# EAGLE schematic iot_solaire_jardin_v2 (EAGLE 9.7.0)
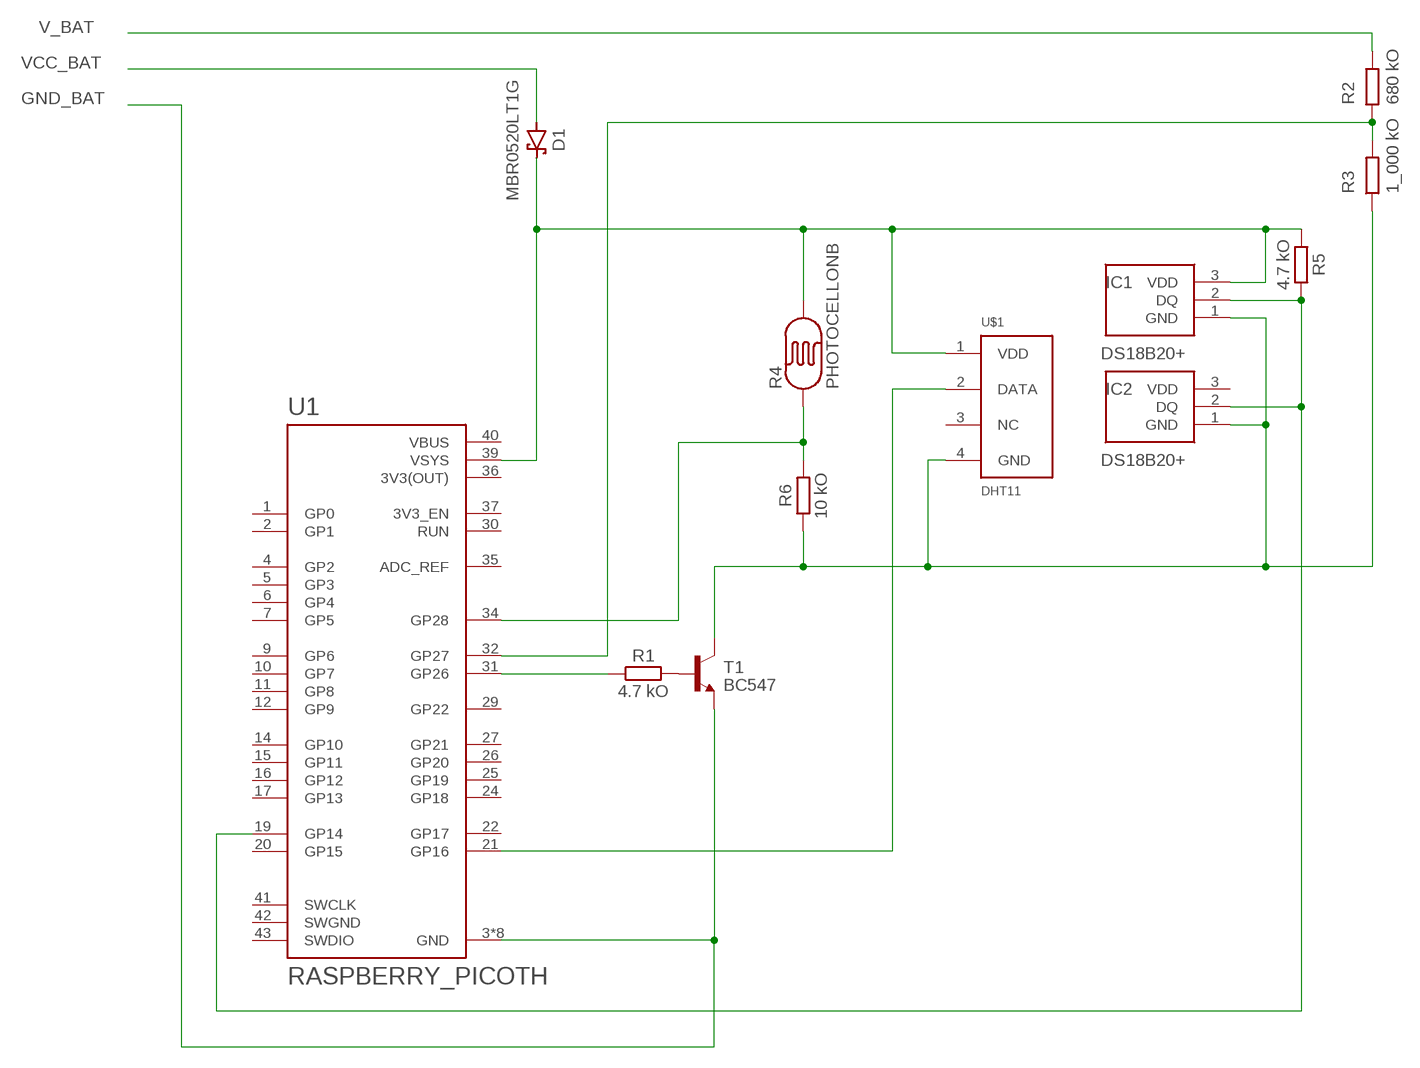
[diagram p0: schematic, sheet 1]

## Parts
D1  MBR0520LT1G  SCHOTTKY_MBR0520LT1GDO-219  [SODFL3718X115]
IC1  DS18B20+  [DS18B20]
IC2  DS18B20+  [DS18B20]
R1  4.7 kO  R_AXIAL-7.2MM-PITCH  [RESAD724W46L381D178B]
R2  680 kO  R  (no package)
R3  1_000 kO  R  (no package)
R4  PHOTOCELLONB  [ON_BOARD]
R5  4.7 kO  R_AXIAL-7.2MM-PITCH  [RESAD724W46L381D178B]
R6  10 kO  R_AXIAL-7.2MM-PITCH  [RESAD724W46L381D178B]
T1  BC547  [TO92]
U1  RASPBERRY_PICOTH  [PICO-PKG-TH]
U$1  DHT11  [DHT11]

## Nets
GND_BAT: T1.1(E) U1.3(GND) U1.8(GND) U1.13(GND) U1.18(GND) U1.23(GND) U1.28(GND) U1.33(GND) U1.38(GND)
N$1: R1.1 U1.31(GP26)
N$2: R1.2 T1.2(B)
N$3: D1.1(C) IC1.3(VDD) R4.2 R5.1 U1.39(VSYS) U$1.1(VDD)
N$4: R2.1 R3.2 U1.32(GP27)
N$5: IC1.2(DQ) IC2.2(DQ) R5.2 U1.19(GP14)
N$7: U1.21(GP16) U$1.2(DATA)
N$8: R4.1 R6.2 U1.34(GP28)
N$13: IC1.1(GND) IC2.1(GND) R3.1 R6.1 T1.3(C) U$1.4(GND)
V_BAT: R2.2
VCC_BAT: D1.2(A)
Unconnected: IC2.3(VDD) U1.1(GP0) U1.2(GP1) U1.4(GP2) U1.5(GP3) U1.6(GP4) U1.7(GP5) U1.9(GP6) U1.10(GP7) U1.11(GP8) U1.12(GP9) U1.14(GP10) U1.15(GP11) U1.16(GP12) U1.17(GP13) U1.20(GP15) U1.22(GP17) U1.24(GP18) U1.25(GP19) U1.26(GP20) U1.27(GP21) U1.29(GP22) U1.30(RUN) U1.35(ADC_REF) U1.37(3V3_EN) U1.41(SWCLK) U1.43(SWDIO) U$1.3(NC)

## Power pins joined to a net without a drawn wire
3V3(OUT): U1.36(3V3(OUT))
SWGND: U1.42(SWGND)
VBUS: U1.40(VBUS)

## Library data of the parts
D1 = Diode:SCHOTTKY_: Schottky Diode - Popular parts; CATEGORY: Diode; DESCRIPTION: DIODE SCHOTTKY 20V 500MA SOD123; MANUFACTURER: ON Semiconductor; MPN: MBR0520LT1G; SUB-CATEGORY: Schottky
IC1 IC2 = DS18B20+:DS18B20+: Board Mount Temperature Sensors Programmable Resolution 1-Wire Digital Thermometer Source: Datasheet <https://ms.componentsearchengine.com/Datasheets/2/DS18B20 .pdf>; DESCRIPTION: Board Mount Temperature Sensors Programmable Resolution 1-Wire Digital Thermometer; HEIGHT: 4.95mm; MANUFACTURER_NAME: Maxim Integrated; MANUFACTURER_PART_NUMBER: DS18B20+; MOUSER_PART_NUMBER: 700-DS18B20+; MOUSER_PRICE-STOCK: https://www.mouser.co.uk/ProductDetail/Maxim-Integrated/DS18B20%2b?qs=7H2Jq%252ByxpJKegCKabDbglA%3D%3D
R1 R5 R6 = Resistor:R: Resistor Fixed - Generic; CATEGORY: Resistor; SUB-CATEGORY: Fixed
R2 R3 = ngspice-simulation:R: RESISTOR
R4 = LDR:PHOTOCELL: Photo Resitor
T1 = transistor:BC547: NPN Transistor
U1 = RpiPico:RASPBERRY_PICO: Raspberry Pi Pico
U$1 = dht:DHT11